# Altium schematic sheet SCREEN.SchDoc
size A4; SheetNumber: 1; SheetTotal: 3
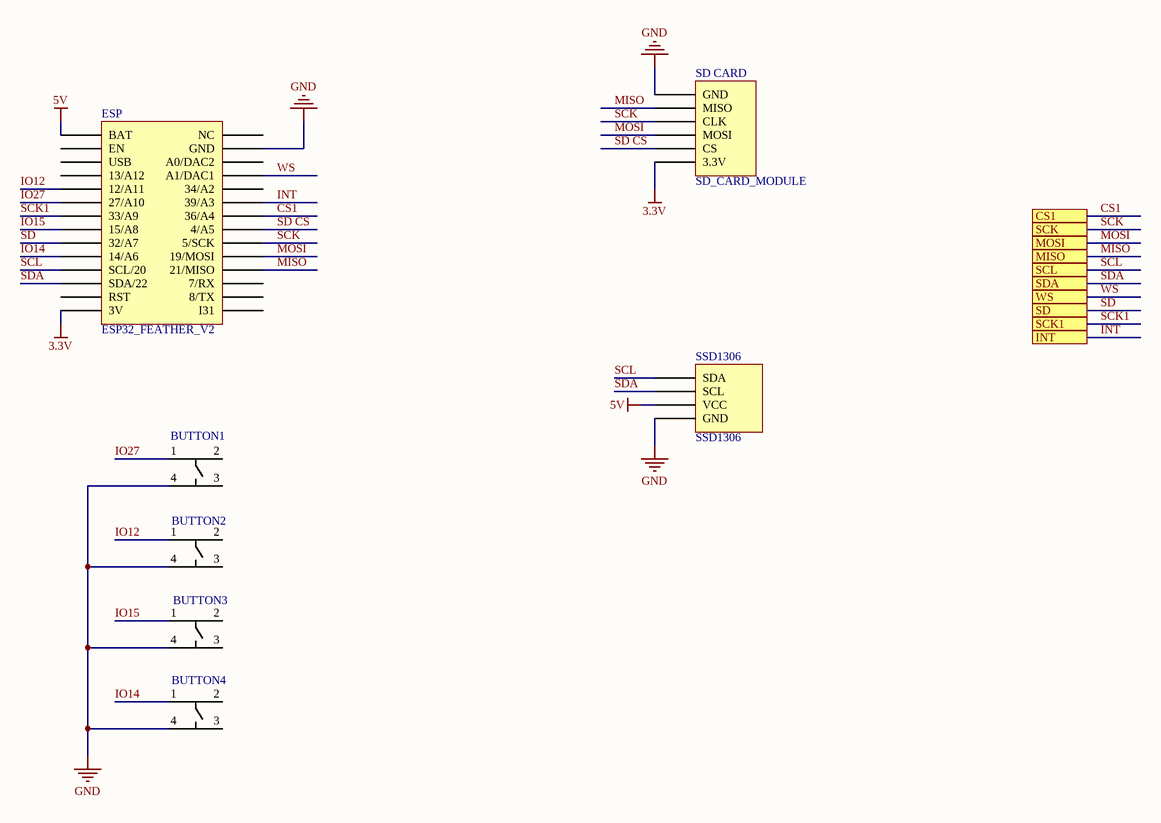
[diagram p0: SCREEN.SchDoc]

## Parts
BUTTON1  BUTTON  [BUTTON 4PIN]  (value not drawn)
BUTTON2  BUTTON  [BUTTON 4PIN]  (value not drawn)
BUTTON3  BUTTON  [BUTTON 4PIN]  (value not drawn)
BUTTON4  BUTTON  [BUTTON 4PIN]  (value not drawn)
ESP  ESP32_FEATHER_V2  [ESP32_FEATHER_V2]
SD_CARD  SD_CARD_MODULE  [MICRO_SD_CARD_MODULE]
SSD1306  SSD1306  [SSD1306]

## Ports
CS1, INT, MISO, MOSI, SCK, SCK1, SCL, SD, SDA, WS

## Nets
3.3V: ESP.15(3V) SD_CARD.6(3.3V)
5V: ESP.17(BAT) SSD1306.3(VCC)
GND: BUTTON1.4 BUTTON2.4 BUTTON3.4 BUTTON4.4 ESP.13(GND) SD_CARD.1(GND) SSD1306.4(GND)
CS1: ESP.8(36/A4) ; port CS1
INT: ESP.9(39/A3) ; port INT
IO12: BUTTON2.1 ESP.21(12/A11)
IO14: BUTTON4.1 ESP.26(14/A6)
IO15: BUTTON3.1 ESP.24(15/A8)
IO27: BUTTON1.1 ESP.22(27/A10)
MISO: ESP.4(21/MISO) SD_CARD.2(MISO) ; port MISO
MOSI: ESP.5(19/MOSI) SD_CARD.4(MOSI) ; port MOSI
SCK: ESP.6(5/SCK) SD_CARD.3(CLK) ; port SCK
SCK1: ESP.23(33/A9) ; port SCK1
SCL: ESP.27(SCL/20) SSD1306.1(SDA) ; port SCL
SD: ESP.25(32/A7) ; port SD
SD CS: ESP.7(4/A5) SD_CARD.5(CS)
SDA: ESP.28(SDA/22) SSD1306.2(SCL) ; port SDA
WS: ESP.11(A1/DAC1) ; port WS

Not connected (* = marked no-connect by the designer): BUTTON1 2 3; BUTTON2 2 3; BUTTON3 2 3; BUTTON4 2 3; ESP 1(I31) 2(8/TX) 3(7/RX) 10(34/A2) 12(A0/DAC2) 14(NC) 16(RST) 18(EN) 19(USB) 20(13/A12)

## Library data of the parts
BUTTON1-BUTTON4 = BUTTON: 6X6X5mm
ESP = ESP32_FEATHER_V2: ESP32 Feather V2
SSD1306 = SSD1306: 0.96 inch, 128x64